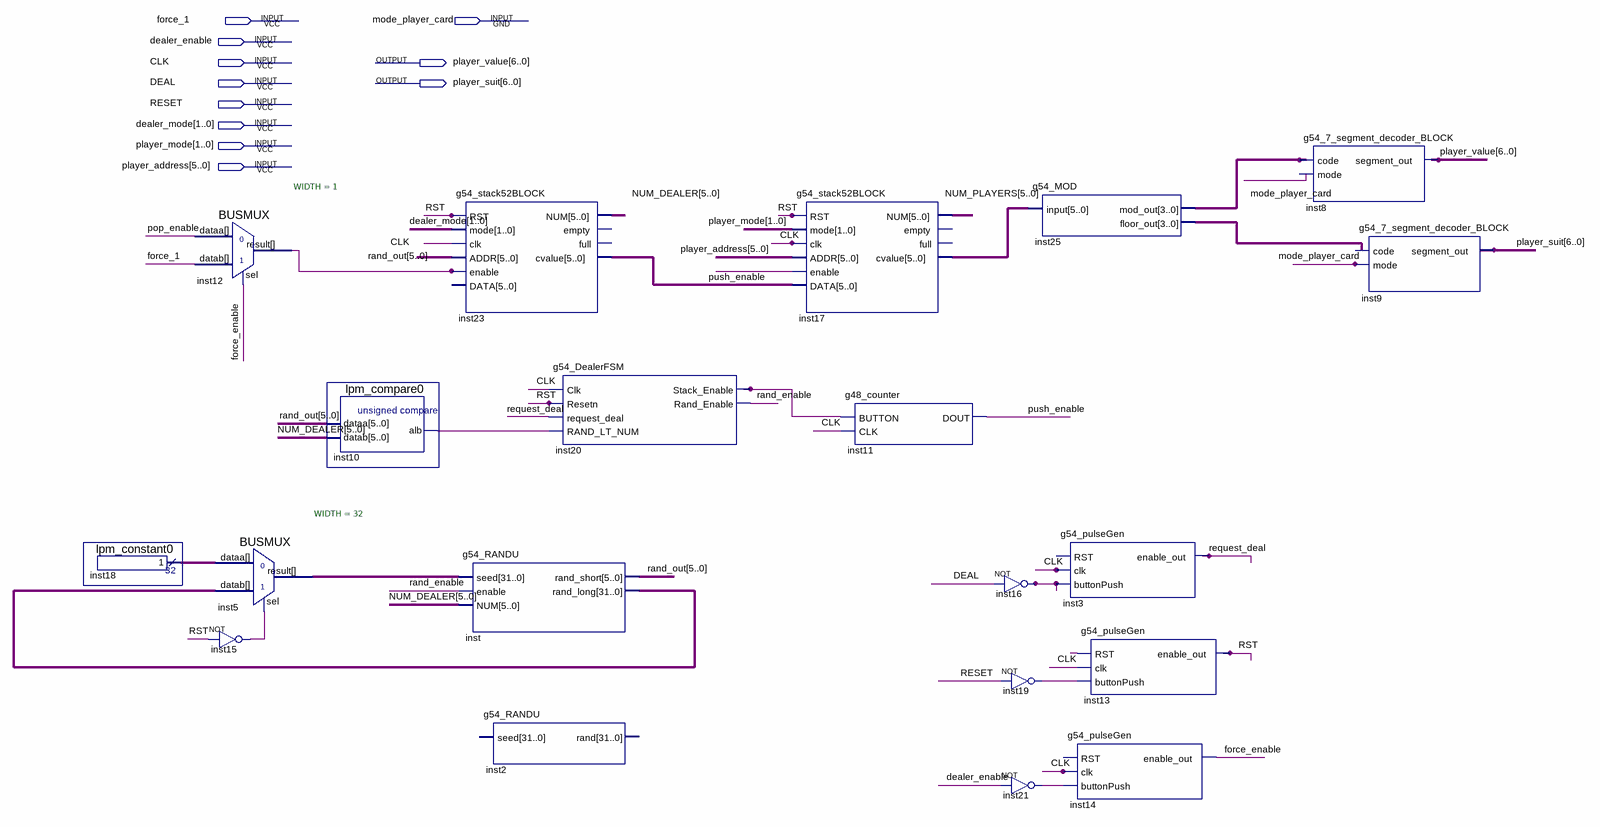
[diagram p0: schematic sheet]
// Quartus schematic g54_lab4_testbed.bdf as structural Verilog: 20 symbols, 11 pins
module g54_lab4_testbed (
  input  force_1,
  input  mode_player_card,
  input  dealer_enable,
  input  CLK,
  input  DEAL,
  input  RESET,
  input  [1:0] dealer_mode,
  input  [1:0] player_mode,
  input  [5:0] player_address,
  output [6:0] player_value,
  output [6:0] player_suit
);

  wire force_enable, inst10_alb, inst12_result, inst15_out, inst16_out, inst19_out, inst20_stack_enable,
       inst21_out, pop_enable, push_enable, rand_enable, request_deal, RST, undriven;
  wire [3:0] inst25_floor_out, inst25_mod_out;
  wire [5:0] inst17_cvalue, inst23_cvalue, NUM_DEALER, NUM_PLAYERS, rand_out;
  wire [31:0] inst5_result, inst18_result, inst_rand_long;

  lpm_constant0 inst18 (.result(inst18_result));
  BUSMUX #(.WIDTH(1)) inst12 (.datab(force_1), .sel(force_enable), .dataa(pop_enable), .result(inst12_result));
  BUSMUX #(.WIDTH(32)) inst5 (.datab(inst_rand_long), .sel(inst15_out), .dataa(inst18_result), .result(inst5_result));
  not inst15 (inst15_out, RST);
  lpm_compare0 inst10 (.dataa(rand_out), .datab(NUM_DEALER), .alb(inst10_alb));
  g54_stack52BLOCK inst23 (
    .RST(RST), .mode(dealer_mode), .clk(CLK), .ADDR(rand_out), .enable(inst12_result), .NUM(NUM_DEALER),
    .cvalue(inst23_cvalue));  // open: DATA, empty, full
  g54_RANDU inst (
    .seed(inst5_result), .enable(rand_enable), .NUM(NUM_DEALER), .rand_short(rand_out),
    .rand_long(inst_rand_long));
  g54_RANDU inst2 ();  // open: seed, rand
  g54_DealerFSM inst20 (
    .Clk(CLK), .Resetn(RST), .request_deal(request_deal), .RAND_LT_NUM(inst10_alb),
    .Stack_Enable(inst20_stack_enable), .Rand_Enable(rand_enable));
  g54_stack52BLOCK inst17 (
    .RST(RST), .mode(player_mode), .clk(CLK), .ADDR(player_address), .enable(push_enable),
    .DATA(inst23_cvalue), .NUM(NUM_PLAYERS), .cvalue(inst17_cvalue));  // open: empty, full
  g48_counter inst11 (.BUTTON(inst20_stack_enable), .CLK(CLK), .DOUT(push_enable));
  not inst16 (inst16_out, DEAL);
  not inst19 (inst19_out, RESET);
  not inst21 (inst21_out, dealer_enable);
  g54_MOD inst25 (.\input (inst17_cvalue), .mod_out(inst25_mod_out), .floor_out(inst25_floor_out));
  g54_pulseGen inst3 (.clk(CLK), .buttonPush(inst16_out), .enable_out(request_deal));  // open: RST
  g54_pulseGen inst14 (.clk(CLK), .buttonPush(inst21_out), .enable_out(force_enable));  // open: RST
  g54_pulseGen inst13 (.RST(undriven), .clk(CLK), .buttonPush(inst19_out), .enable_out(RST));
  g54_7_segment_decoder_BLOCK inst8 (.code(inst25_mod_out), .segment_out(player_value));  // open: mode
  g54_7_segment_decoder_BLOCK inst9 (.mode(mode_player_card), .segment_out(player_suit));  // open: code
endmodule
